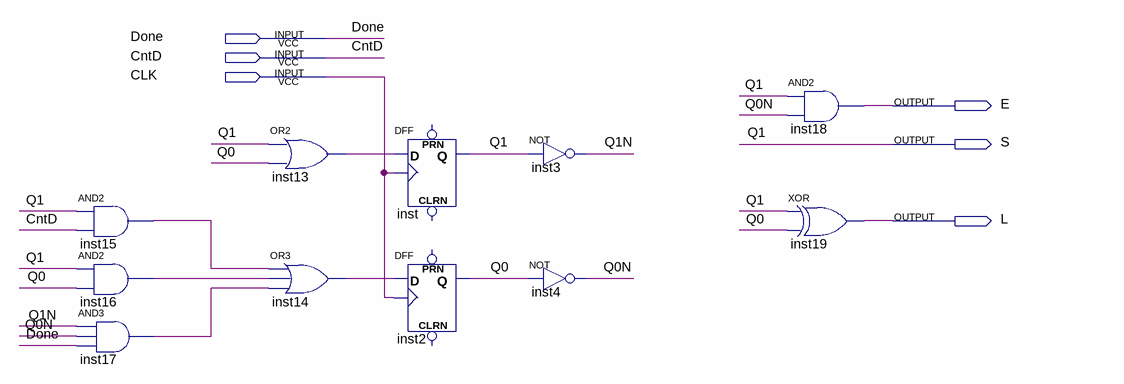
[diagram p0: schematic sheet]
// Quartus schematic Control_unit.bdf as structural Verilog: 11 symbols, 6 pins
module Control_unit (
  input  Done,
  input  CntD,
  input  CLK,
  output E,
  output S,
  output L
);

  wire inst13_out, inst14_out, inst15_out, inst16_out, inst17_out, Q0, Q0N, Q1N;

  and inst15 (inst15_out, S, CntD);
  and inst16 (inst16_out, S, Q0);
  and inst17 (inst17_out, Q1N, Q0N, Done);
  or inst13 (inst13_out, S, Q0);
  or inst14 (inst14_out, inst15_out, inst16_out, inst17_out);
  DFF inst (.CLK(CLK), .D(inst13_out), .Q(S));  // open: CLRN, PRN
  DFF inst2 (.CLK(CLK), .D(inst14_out), .Q(Q0));  // open: CLRN, PRN
  not inst3 (Q1N, S);
  not inst4 (Q0N, Q0);
  and inst18 (E, S, Q0N);
  xor inst19 (L, S, Q0);

  // Other names for the same wires on the sheet: Q1 = S
endmodule
